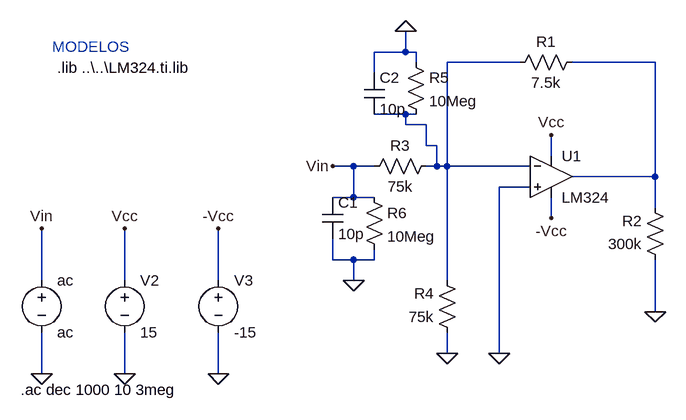
[diagram p0: schematic Modelo-1.asc]
Modelo-1.asc, the LTspice schematic file:
Version 4
SHEET 1 1860 680
WIRE 272 -320 272 -352
WIRE 272 -320 224 -320
WIRE 288 -320 272 -320
WIRE 288 -304 288 -320
WIRE 448 -304 336 -304
WIRE 656 -304 528 -304
WIRE 224 -288 224 -320
WIRE 272 -224 224 -224
WIRE 288 -224 272 -224
WIRE 272 -208 272 -224
WIRE 304 -208 272 -208
WIRE 304 -176 304 -208
WIRE 320 -176 304 -176
WIRE 496 -160 496 -192
WIRE 192 -144 160 -144
WIRE 224 -144 192 -144
WIRE 320 -144 320 -176
WIRE 320 -144 304 -144
WIRE 336 -144 336 -304
WIRE 336 -144 320 -144
WIRE 464 -144 336 -144
WIRE 656 -128 656 -304
WIRE 656 -128 528 -128
WIRE 464 -112 416 -112
WIRE 192 -96 192 -144
WIRE 192 -96 160 -96
WIRE 224 -96 192 -96
WIRE 656 -80 656 -128
WIRE 496 -64 496 -96
WIRE 160 0 160 -32
WIRE 192 0 160 0
WIRE 224 0 224 -16
WIRE 224 0 192 0
WIRE -288 32 -288 -48
WIRE -160 32 -160 -48
WIRE -16 32 -16 -48
WIRE 192 32 192 0
WIRE 336 32 336 -144
WIRE 656 80 656 0
WIRE 336 144 336 112
WIRE 416 144 416 -112
WIRE -288 176 -288 112
WIRE -160 176 -160 112
WIRE -16 176 -16 112
FLAG 336 144 0
FLAG 416 144 0
FLAG -288 176 0
FLAG -160 176 0
FLAG -16 176 0
FLAG -160 -48 Vcc
FLAG 496 -192 Vcc
FLAG -16 -48 -Vcc
FLAG 496 -64 -Vcc
FLAG -288 -48 Vin
FLAG 160 -144 Vin
FLAG 656 80 0
FLAG 192 32 0
FLAG 272 -352 0
SYMBOL Opamps\\opamp2 496 -192 R0
SYMATTR InstName U1
SYMATTR Value LM324
SYMBOL voltage -288 16 R0
WINDOW 123 0 0 Left 0
WINDOW 39 0 0 Left 0
SYMATTR InstName ac
SYMATTR Value ac
SYMBOL voltage -160 16 R0
WINDOW 123 0 0 Left 0
WINDOW 39 0 0 Left 0
SYMATTR InstName V2
SYMATTR Value 15
SYMBOL voltage -16 16 R0
WINDOW 123 0 0 Left 0
WINDOW 39 0 0 Left 0
SYMATTR InstName V3
SYMATTR Value -15
SYMBOL res 320 -160 R90
WINDOW 0 0 56 VBottom 2
WINDOW 3 32 56 VTop 2
SYMATTR InstName R3
SYMATTR Value 75k
SYMBOL res 352 128 R180
WINDOW 0 36 76 Left 2
WINDOW 3 36 40 Left 2
SYMATTR InstName R4
SYMATTR Value 75k
SYMBOL res 544 -320 R90
WINDOW 0 0 56 VBottom 2
WINDOW 3 32 56 VTop 2
SYMATTR InstName R1
SYMATTR Value 7.5k
SYMBOL res 672 16 R180
WINDOW 0 36 76 Left 2
WINDOW 3 36 40 Left 2
SYMATTR InstName R2
SYMATTR Value 300k
SYMBOL cap 144 -96 R0
SYMATTR InstName C1
SYMATTR Value 10p
SYMBOL cap 208 -288 R0
SYMATTR InstName C2
SYMATTR Value 10p
SYMBOL res 272 -320 R0
SYMATTR InstName R5
SYMATTR Value 10Meg
SYMBOL res 208 -112 R0
SYMATTR InstName R6
SYMATTR Value 10Meg
TEXT -264 -296 Left 2 !.lib ..\\..\\LM324.ti.lib
TEXT -272 -328 Left 2 ;MODELOS
TEXT -320 200 Left 2 !.ac dec 1000 10 3meg

The netlist it stands for:
* Modelo-1.asc
XU1 0 N001 Vcc -Vcc N002 LM324  ; pins In+ In- V+ V- OUT
V§ac Vin 0 ac
V2 Vcc 0 15
V3 -Vcc 0 -15
R3 N001 Vin 75k
R4 0 N001 75k
R1 N002 N001 7.5k
R2 0 N002 300k
C1 Vin 0 10p
C2 0 N001 10p
R5 0 N001 10Meg
R6 Vin 0 10Meg
.lib ..\..\LM324.ti.lib
* MODELOS
.ac dec 1000 10 3meg
.backanno
.end